# Altium schematic sheet cdh.SchDoc
size A3
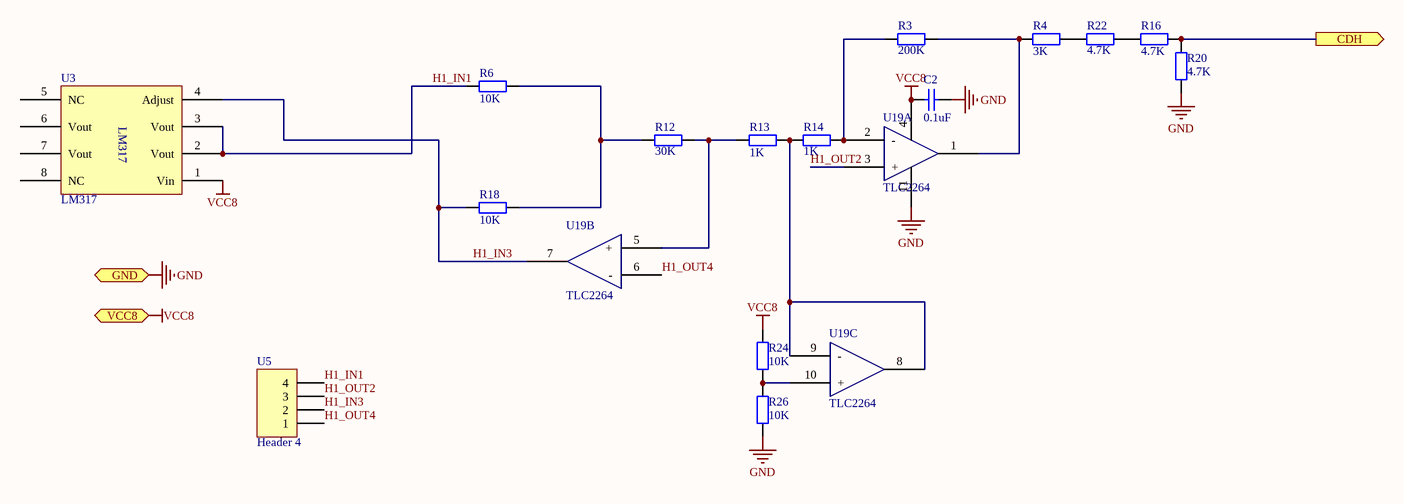
[diagram p0: cdh.SchDoc]

## Parts
C2  0.1uF  [C0805]
R3  200K  [0603_R]
R4  3K  [0603_R]
R6  10K  [0603_R]
R12  30K  [0603_R]
R13  1K  [0603_R]
R14  1K  [0603_R]
R16  4.7K  [0603_R]
R18  10K  [0603_R]
R20  4.7K  [0603_R]
R22  4.7K  [0603_R]
R24  10K  [0603_R]
R26  10K  [0603_R]
U3  LM317  [SO-8]
U5  Header 4  [PIN4]
U19  TLC2264  [TSSOP14]  (parts A,B,C of 4)

## Ports
CDH (out), GND (bidir), VCC8 (bidir)

## Nets
GND: C2.1 R20.1 R26.1 U19.11(GND) ; port GND
VCC8: C2.2 R24.2 U3.1(Vin) U19.4(VCC) ; port VCC8
CDH: R16.2 R20.2 ; port CDH
H1_IN1: R6.1 U3.2(Vout) U3.3(Vout) U5.4
H1_IN3: R18.1 U3.4(Adjust) U5.2 U19.7(2OUT)
H1_OUT2: U5.3 U19.3(+)
H1_OUT4: U5.1 U19.6(-)
NetR3_1: R3.1 R14.1 U19.2(-)
NetR3_2: R3.2 R4.1 U19.1(1OUT)
NetR4_2: R4.2 R22.1
NetR6_2: R6.2 R12.1 R18.2
NetR12_2: R12.2 R13.1 U19.5(+)
NetR13_2: R13.2 R14.2 U19.8(3OUT) U19.9(-)
NetR16_1: R16.1 R22.2
NetR24_1: R24.1 R26.2 U19.10(+)

Not connected (* = marked no-connect by the designer): U3 5(NC) 6(Vout) 7(Vout) 8(NC)

## Library data of the parts
C2 = Cap Semi: Capacitor (Semiconductor SIM Model); Published: 8-Jun-2000; LatestRevisionDate: 29-May-2009; LatestRevisionNote: IPC-7351 Footprint Added.; PackageReference: C1206; Publisher: Altium Limited; PackageDescription: Chip Capacitor; Value: 0.1uF
R3 = Res2: Resistor; Value: 390K; Published: 8-Jun-2000; LatestRevisionDate: 17-Jul-2002; LatestRevisionNote: Re-released for DXP Platform.; PackageReference: AXIAL-0.4; Publisher: Altium Limited; PackageDescription: Axial Device, Thru-Hole; 2 Leads; 0.4 in Pin Spacing
R4 R6 R12-R14 R16 R18 R20 R24 R26 = Res2: Resistor; Published: 8-Jun-2000; LatestRevisionDate: 17-Jul-2002; LatestRevisionNote: Re-released for DXP Platform.; PackageReference: AXIAL-0.4; Publisher: Altium Limited; PackageDescription: Axial Device, Thru-Hole; 2 Leads; 0.4 in Pin Spacing
  R4: Value: 3K
  R6 R18 R24 R26: Value: 10K
  R12: Value: 30K
  R13 R14: Value: 1K
  R16 R20: Value: 4.7K
R22 = Res2: Resistor; Value: 1M; Published: 8-Jun-2000; LatestRevisionDate: 17-Jul-2002; LatestRevisionNote: Re-released for DXP Platform.; PackageReference: AXIAL-0.4; Publisher: Altium Limited; PackageDescription: Axial Device, Thru-Hole; 2 Leads; 0.4 in Pin Spacing
U5 = Header 4: Header, 4-Pin; LatestRevisionDate: 17-Jul-2002; LatestRevisionNote: Re-released for DXP Platform.; Publisher: Altium Limited